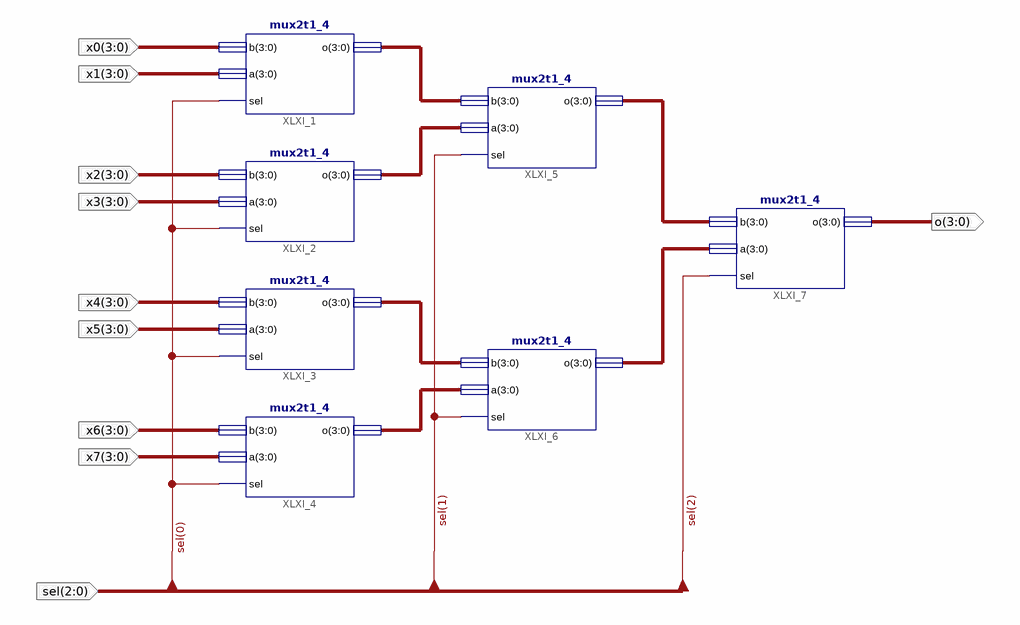
[diagram p0: schematic sheet 1]
// Xilinx ISE schematic mux8t1_4.sch (kintex7) as structural Verilog: 7 symbols, 10 ports
module mux8t1_4 (
  input  [2:0] sel,
  input  [3:0] x0,
  input  [3:0] x1,
  input  [3:0] x2,
  input  [3:0] x3,
  input  [3:0] x4,
  input  [3:0] x5,
  input  [3:0] x6,
  input  [3:0] x7,
  output [3:0] o
);

  wire [3:0] XLXN_20, XLXN_21, XLXN_22, XLXN_23, XLXN_24, XLXN_25;

  mux2t1_4 XLXI_1 (.b(x0), .a(x1), .sel(sel[0]), .o(XLXN_20));
  mux2t1_4 XLXI_2 (.b(x2), .a(x3), .sel(sel[0]), .o(XLXN_21));
  mux2t1_4 XLXI_3 (.b(x4), .a(x5), .sel(sel[0]), .o(XLXN_22));
  mux2t1_4 XLXI_4 (.b(x6), .a(x7), .sel(sel[0]), .o(XLXN_23));
  mux2t1_4 XLXI_5 (.b(XLXN_20), .a(XLXN_21), .sel(sel[1]), .o(XLXN_25));
  mux2t1_4 XLXI_6 (.b(XLXN_22), .a(XLXN_23), .sel(sel[1]), .o(XLXN_24));
  mux2t1_4 XLXI_7 (.b(XLXN_25), .a(XLXN_24), .sel(sel[2]), .o(o));
endmodule
